# Altium schematic sheet OLED.SchDoc
size A4; DocumentNumber: 13; SheetNumber: ALT0056; SheetTotal: 21
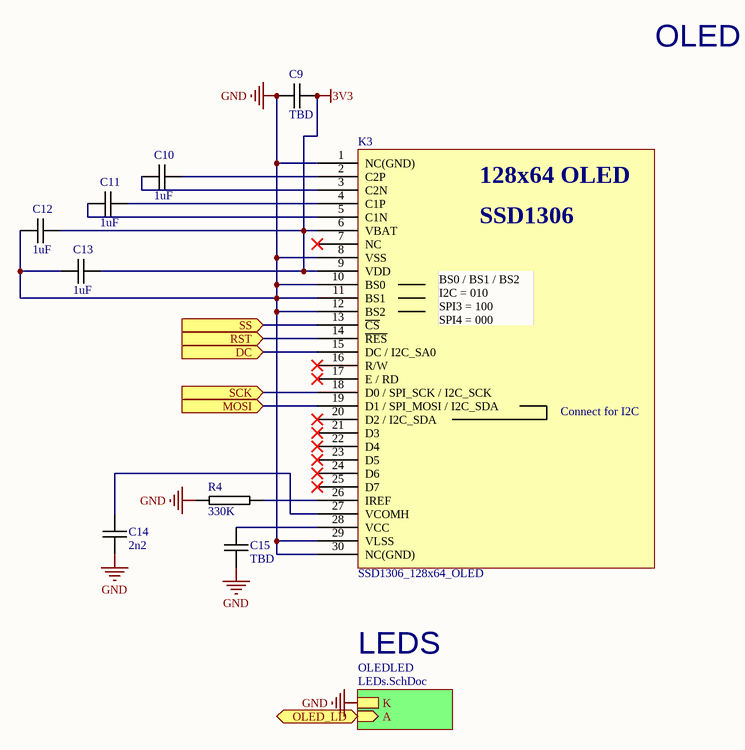
[diagram p0: OLED.SchDoc]

## Parts
C9  TBD  [1210C-GENERIC]
C10  1uF  [0603C-GENERIC]
C11  1uF  [0603C-GENERIC]
C12  1uF  [0603C-GENERIC]
C13  1uF  [0603C-GENERIC]
C14  2n2  [0603C-GENERIC]
C15  TBD  [1210C-GENERIC]
K3  SSD1306_128x64_OLED  [SSD1306_128x64_OLED]
R4  330K  [0603R-330K]

## Sub-sheets
OLEDLED = LEDs.SchDoc: K, A (in)

## Ports
DC (in), MOSI (in), OLED_LD (in), RST (in), SCK (in), SS (in)

## Nets
3V3: C9.2 C12.2 C13.2 K3.6(VBAT) K3.9(VDD)
GND: C9.1 C12.1 C13.1 C14.2 C15.1 K3.1(NC(GND)) K3.8(VSS) K3.10(BS0) K3.11(BS1) K3.12(BS2) K3.29(VLSS) K3.30(NC(GND)) R4.1 ; sheet OLEDLED/K
DC: K3.15(DC_/_I2C_SA0) ; port DC
MOSI: K3.19(D1_/_SPI_MOSI_/_I2C_SDA) ; port MOSI
OLED_LD: port OLED_LD, sheet OLEDLED/A
RST: K3.14(~{RES}) ; port RST
SCK: K3.18(D0_/_SPI_SCK_/_I2C_SCK) ; port SCK
SS: K3.13(~{CS}) ; port SS
NetC10_1: C10.1 K3.3(C2N)
NetC10_2: C10.2 K3.2(C2P)
NetC11_1: C11.1 K3.5(C1N)
NetC11_2: C11.2 K3.4(C1P)
NetC14_1: C14.1 K3.27(VCOMH)
NetC15_2: C15.2 K3.28(VCC)
NetK3_26: K3.26(IREF) R4.2

Not connected (* = marked no-connect by the designer): K3 7(NC)* 16(R/W)* 17(E_/_RD)* 20(D2_/_I2C_SDA)* 21(D3)* 22(D4)* 23(D5)* 24(D6)* 25(D7)*

## Notes on the sheet
- OLED
- LEDS
- Title
- Size:
- Date:
- A4
- Number:
- Time:
- Revision:
- Sheet
- of
- File:
- (in symbol SSD1306_128x64_OLED) 128x64 OLED; SSD1306; BS0 / BS1 / BS2 / I2C = 010 / SPI3 = 100 / SPI4 = 000; Connect for I2C

## Library data of the parts
C9 C15 = Passives_Capacitors_1210_1210C-TBD: CAPACITOR 1210 CERAMIC VALUE TO BE DETERMINED
C10-C13 = 0603C-1UF-35V-X5R-TAY: CAPACITOR 0603 CERAMIC; Manufacturer Part Number: GMK107BJ105KA-T; Manufacturer: Taiyo Yuden; Reel: C92; Supplier 1: Digi-Key; Supplier Part Number 1: 587-1437-2-ND
C14 = 0603C-2N2-50V-C0G-MUR: CAPACITOR 0603 CERAMIC; Reel: C4
K3 = SSD1306_128x64_OLED: SSD1306 OLED 128x64
R4 = 0603R-330K: GENERIC RESISTOR 0603; Manufacturer: Stackpole Electronics Inc; Manufacturer Part Number: RMCF 1/16 330K 1% R; Temperature Coefficient: ±100ppm/°C; Power (Watts): 0.1W, 1/10W; Tolerance: ±1%; Supplier 1: Digi-Key; Supplier Part Number 1: RMCF1/16330KFRCT-ND; Resistance In Ohms: 330K; Supplier Part Number: RMCF1/16330KFRCT-ND; Packaging: Cut Tape (CT); RoHS: RoHS Compliant; Composition: Thick Film; Supplier: Digi-Key; Lead Style: Surface Mount (SMD - SMT); Category: Resistors; Case: 0603 (1608 metric)